# Altium schematic sheet Connectors.SchDoc
size A3; SheetNumber: 4; SheetTotal: 7
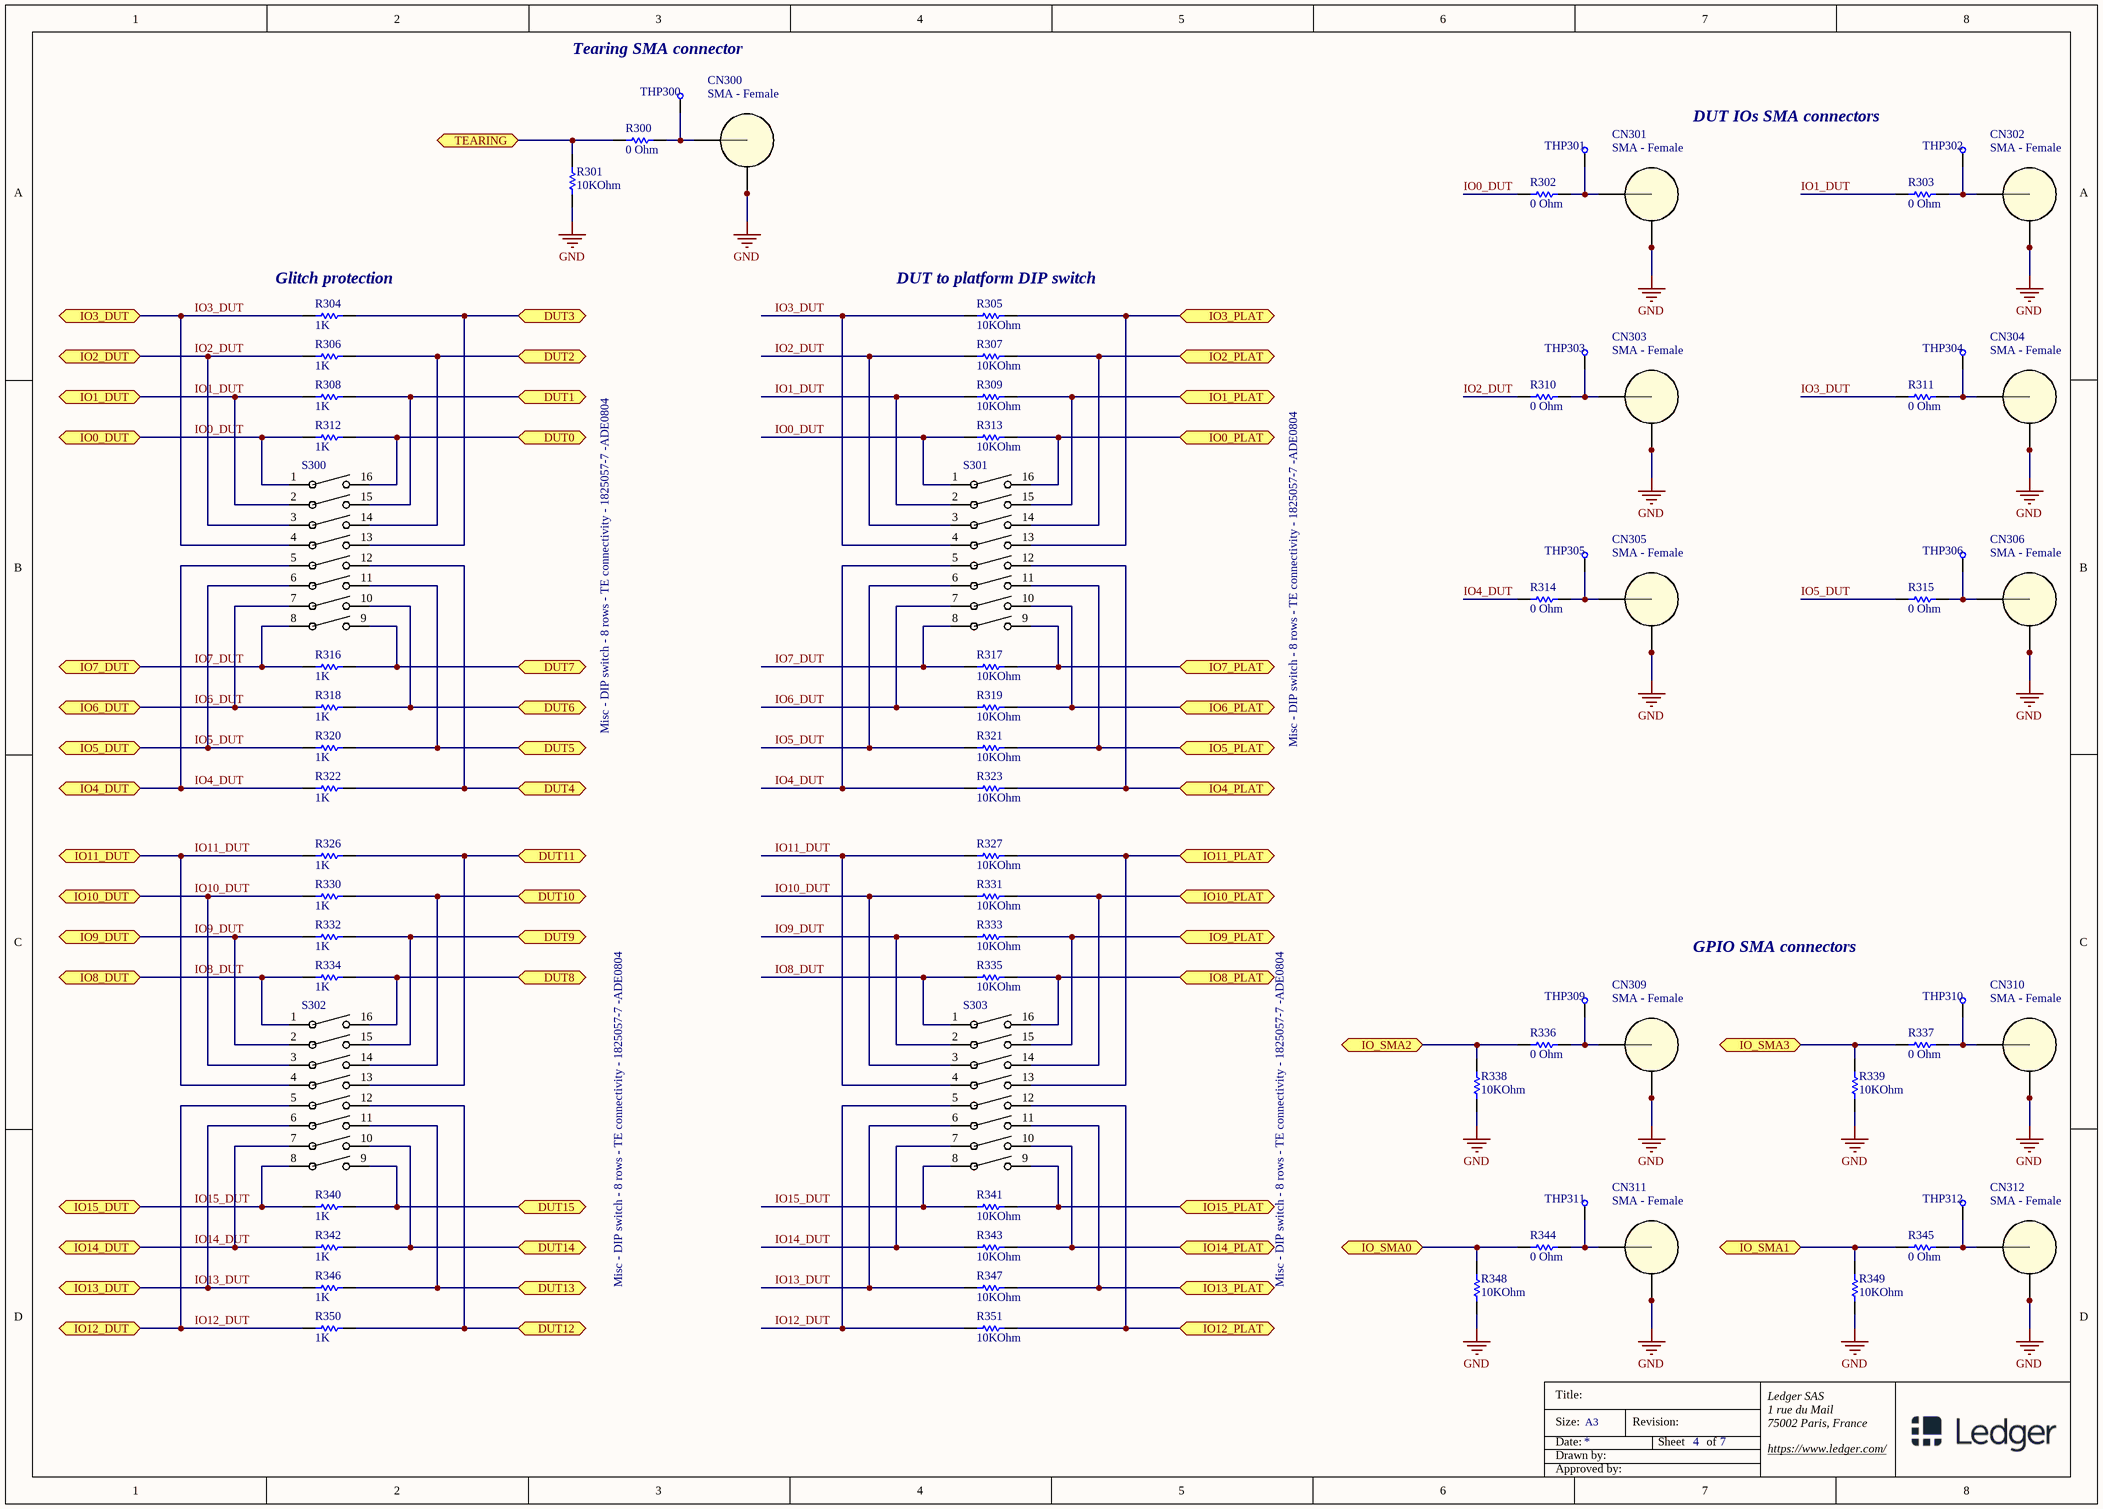
[diagram p0: Connectors.SchDoc]

## Parts
CN300  SMA - Female  [SAMTEC_SMA-J-P-X-ST-EM3]
CN301  SMA - Female  [SAMTEC_SMA-J-P-X-ST-EM3]
CN302  SMA - Female  [SAMTEC_SMA-J-P-X-ST-EM3]
CN303  SMA - Female  [SAMTEC_SMA-J-P-X-ST-EM3]
CN304  SMA - Female  [SAMTEC_SMA-J-P-X-ST-EM3]
CN305  SMA - Female  [SAMTEC_SMA-J-P-X-ST-EM3]
CN306  SMA - Female  [SAMTEC_SMA-J-P-X-ST-EM3]
CN309  SMA - Female  [SAMTEC_SMA-J-P-X-ST-EM3]
CN310  SMA - Female  [SAMTEC_SMA-J-P-X-ST-EM3]
CN311  SMA - Female  [SAMTEC_SMA-J-P-X-ST-EM3]
CN312  SMA - Female  [SAMTEC_SMA-J-P-X-ST-EM3]
R300  0 Ohm  [RES0603]
R301  10KOhm  [RES0603]
R302  0 Ohm  [RES0603]
R303  0 Ohm  [RES0603]
R304  1K  [RES0603]
R305  10KOhm  [RES0603]
R306  1K  [RES0603]
R307  10KOhm  [RES0603]
R308  1K  [RES0603]
R309  10KOhm  [RES0603]
R310  0 Ohm  [RES0603]
R311  0 Ohm  [RES0603]
R312  1K  [RES0603]
R313  10KOhm  [RES0603]
R314  0 Ohm  [RES0603]
R315  0 Ohm  [RES0603]
R316  1K  [RES0603]
R317  10KOhm  [RES0603]
R318  1K  [RES0603]
R319  10KOhm  [RES0603]
R320  1K  [RES0603]
R321  10KOhm  [RES0603]
R322  1K  [RES0603]
R323  10KOhm  [RES0603]
R326  1K  [RES0603]
R327  10KOhm  [RES0603]
R330  1K  [RES0603]
R331  10KOhm  [RES0603]
R332  1K  [RES0603]
R333  10KOhm  [RES0603]
R334  1K  [RES0603]
R335  10KOhm  [RES0603]
R336  0 Ohm  [RES0603]
R337  0 Ohm  [RES0603]
R338  10KOhm  [RES0603]
R339  10KOhm  [RES0603]
R340  1K  [RES0603]
R341  10KOhm  [RES0603]
R342  1K  [RES0603]
R343  10KOhm  [RES0603]
R344  0 Ohm  [RES0603]
R345  0 Ohm  [RES0603]
R346  1K  [RES0603]
R347  10KOhm  [RES0603]
R348  10KOhm  [RES0603]
R349  10KOhm  [RES0603]
R350  1K  [RES0603]
R351  10KOhm  [RES0603]
S300  Misc - DIP switch - 8 rows - TE connectivity - 1825057-7 -ADE0804  [SWDIP16_300X3.51]
S301  Misc - DIP switch - 8 rows - TE connectivity - 1825057-7 -ADE0804  [SWDIP16_300X3.51]
S302  Misc - DIP switch - 8 rows - TE connectivity - 1825057-7 -ADE0804  [SWDIP16_300X3.51]
S303  Misc - DIP switch - 8 rows - TE connectivity - 1825057-7 -ADE0804  [SWDIP16_300X3.51]
THP300  Misc - Test pin - Through hole - Millmax - 6821-0-00-15-00-00-08-0  [MILLMAX_6821-0-00-15-00-00-08-0]  (value not drawn)
THP301  Misc - Test pin - Through hole - Millmax - 6821-0-00-15-00-00-08-0  [MILLMAX_6821-0-00-15-00-00-08-0]  (value not drawn)
THP302  Misc - Test pin - Through hole - Millmax - 6821-0-00-15-00-00-08-0  [MILLMAX_6821-0-00-15-00-00-08-0]  (value not drawn)
THP303  Misc - Test pin - Through hole - Millmax - 6821-0-00-15-00-00-08-0  [MILLMAX_6821-0-00-15-00-00-08-0]  (value not drawn)
THP304  Misc - Test pin - Through hole - Millmax - 6821-0-00-15-00-00-08-0  [MILLMAX_6821-0-00-15-00-00-08-0]  (value not drawn)
THP305  Misc - Test pin - Through hole - Millmax - 6821-0-00-15-00-00-08-0  [MILLMAX_6821-0-00-15-00-00-08-0]  (value not drawn)
THP306  Misc - Test pin - Through hole - Millmax - 6821-0-00-15-00-00-08-0  [MILLMAX_6821-0-00-15-00-00-08-0]  (value not drawn)
THP309  Misc - Test pin - Through hole - Millmax - 6821-0-00-15-00-00-08-0  [MILLMAX_6821-0-00-15-00-00-08-0]  (value not drawn)
THP310  Misc - Test pin - Through hole - Millmax - 6821-0-00-15-00-00-08-0  [MILLMAX_6821-0-00-15-00-00-08-0]  (value not drawn)
THP311  Misc - Test pin - Through hole - Millmax - 6821-0-00-15-00-00-08-0  [MILLMAX_6821-0-00-15-00-00-08-0]  (value not drawn)
THP312  Misc - Test pin - Through hole - Millmax - 6821-0-00-15-00-00-08-0  [MILLMAX_6821-0-00-15-00-00-08-0]  (value not drawn)

## Ports
DUT0, DUT1, DUT2, DUT3, DUT4, DUT5, DUT6, DUT7, DUT8, DUT9, DUT10, DUT11, DUT12, DUT13, DUT14, DUT15, IO0_DUT, IO0_PLAT, IO1_DUT, IO1_PLAT, IO2_DUT, IO2_PLAT, IO3_DUT, IO3_PLAT, IO4_DUT, IO4_PLAT, IO5_DUT, IO5_PLAT, IO6_DUT, IO6_PLAT, IO7_DUT, IO7_PLAT, IO8_DUT, IO8_PLAT, IO9_DUT, IO9_PLAT, IO10_DUT, IO10_PLAT, IO11_DUT, IO11_PLAT, IO12_DUT, IO12_PLAT, IO13_DUT, IO13_PLAT, IO14_DUT, IO14_PLAT, IO15_DUT, IO15_PLAT, IO_SMA0, IO_SMA1, IO_SMA2, IO_SMA3, TEARING

## Nets
GND: CN300.2 CN300.3 CN301.2 CN301.3 CN302.2 CN302.3 CN303.2 CN303.3 CN304.2 CN304.3 CN305.2 CN305.3 CN306.2 CN306.3 CN309.2 CN309.3 CN310.2 CN310.3 CN311.2 CN311.3 CN312.2 CN312.3 R301.1 R338.1 R339.1 R348.1 R349.1
DUT0: R312.2 S300.16 ; port DUT0
DUT1: R308.2 S300.15 ; port DUT1
DUT2: R306.2 S300.14 ; port DUT2
DUT3: R304.2 S300.13 ; port DUT3
DUT4: R322.2 S300.12 ; port DUT4
DUT5: R320.2 S300.11 ; port DUT5
DUT6: R318.2 S300.10 ; port DUT6
DUT7: R316.2 S300.9 ; port DUT7
DUT8: R334.2 S302.16 ; port DUT8
DUT9: R332.2 S302.15 ; port DUT9
DUT10: R330.2 S302.14 ; port DUT10
DUT11: R326.2 S302.13 ; port DUT11
DUT12: R350.2 S302.12 ; port DUT12
DUT13: R346.2 S302.11 ; port DUT13
DUT14: R342.2 S302.10 ; port DUT14
DUT15: R340.2 S302.9 ; port DUT15
IO0_DUT: R302.1 R312.1 R313.1 S300.1 S301.1 ; port IO0_DUT
IO0_PLAT: R313.2 S301.16 ; port IO0_PLAT
IO1_DUT: R303.1 R308.1 R309.1 S300.2 S301.2 ; port IO1_DUT
IO1_PLAT: R309.2 S301.15 ; port IO1_PLAT
IO2_DUT: R306.1 R307.1 R310.1 S300.3 S301.3 ; port IO2_DUT
IO2_PLAT: R307.2 S301.14 ; port IO2_PLAT
IO3_DUT: R304.1 R305.1 R311.1 S300.4 S301.4 ; port IO3_DUT
IO3_PLAT: R305.2 S301.13 ; port IO3_PLAT
IO4_DUT: R314.1 R322.1 R323.1 S300.5 S301.5 ; port IO4_DUT
IO4_PLAT: R323.2 S301.12 ; port IO4_PLAT
IO5_DUT: R315.1 R320.1 R321.1 S300.6 S301.6 ; port IO5_DUT
IO5_PLAT: R321.2 S301.11 ; port IO5_PLAT
IO6_DUT: R318.1 R319.1 S300.7 S301.7 ; port IO6_DUT
IO6_PLAT: R319.2 S301.10 ; port IO6_PLAT
IO7_DUT: R316.1 R317.1 S300.8 S301.8 ; port IO7_DUT
IO7_PLAT: R317.2 S301.9 ; port IO7_PLAT
IO8_DUT: R334.1 R335.1 S302.1 S303.1 ; port IO8_DUT
IO8_PLAT: R335.2 S303.16 ; port IO8_PLAT
IO9_DUT: R332.1 R333.1 S302.2 S303.2 ; port IO9_DUT
IO9_PLAT: R333.2 S303.15 ; port IO9_PLAT
IO10_DUT: R330.1 R331.1 S302.3 S303.3 ; port IO10_DUT
IO10_PLAT: R331.2 S303.14 ; port IO10_PLAT
IO11_DUT: R326.1 R327.1 S302.4 S303.4 ; port IO11_DUT
IO11_PLAT: R327.2 S303.13 ; port IO11_PLAT
IO12_DUT: R350.1 R351.1 S302.5 S303.5 ; port IO12_DUT
IO12_PLAT: R351.2 S303.12 ; port IO12_PLAT
IO13_DUT: R346.1 R347.1 S302.6 S303.6 ; port IO13_DUT
IO13_PLAT: R347.2 S303.11 ; port IO13_PLAT
IO14_DUT: R342.1 R343.1 S302.7 S303.7 ; port IO14_DUT
IO14_PLAT: R343.2 S303.10 ; port IO14_PLAT
IO15_DUT: R340.1 R341.1 S302.8 S303.8 ; port IO15_DUT
IO15_PLAT: R341.2 S303.9 ; port IO15_PLAT
IO_SMA0: R344.1 R348.2 ; port IO_SMA0
IO_SMA1: R345.1 R349.2 ; port IO_SMA1
IO_SMA2: R336.1 R338.2 ; port IO_SMA2
IO_SMA3: R337.1 R339.2 ; port IO_SMA3
TEARING: R300.1 R301.2 ; port TEARING
NetCN300_1: CN300.1 R300.2 THP300.1
NetCN301_1: CN301.1 R302.2 THP301.1
NetCN302_1: CN302.1 R303.2 THP302.1
NetCN303_1: CN303.1 R310.2 THP303.1
NetCN304_1: CN304.1 R311.2 THP304.1
NetCN305_1: CN305.1 R314.2 THP305.1
NetCN306_1: CN306.1 R315.2 THP306.1
NetCN309_1: CN309.1 R336.2 THP309.1
NetCN310_1: CN310.1 R337.2 THP310.1
NetCN311_1: CN311.1 R344.2 THP311.1
NetCN312_1: CN312.1 R345.2 THP312.1

## Notes on the sheet
- (near THP300) Tearing SMA connector
- DUT IOs SMA connectors
- (near R304) Glitch protection
- (near R305) DUT to platform DIP switch
- GPIO SMA connectors
- Title:
- Size:
- Date:
- Drawn by:
- A3
- Revision:
- Sheet
- of
- Ledger SAS
- 1 rue du Mail
- 75002 Paris, France
- https://www.ledger.com/
- Approved by:

## Library data of the parts
CN300-CN306 CN309-CN312 = Connector - SMA - Female - Horizontal - Mid Mount - Samtec - SMA–J–P–H–ST–EM3: pin to pad: 1>S1 2>G1 3>G2; Impedance: 50 Ohms; Manufacturer: Samtec; Manufacturer PN: SMA–J–P–H–ST–EM3; Type: SMA; Gender: Female
R300 R302 R303 R310 R311 R314 R315 R336 R337 R344 R345 = Resistor 0603 -        0Ohm - 1/10W - 1%: Resistor 0603 - 0Ohm - 1/10W - 1%; Manufacturer PN: CRCW06030000FKEA; Manufacturer: Vishay; PkgCode: 0603; Value: 0 Ohm; Power: 1/10W; Tolerance: 1%
R301 R305 R307 R309 R313 R317 R319 R321 R323 R327 R331 R333 R335 R338 R339 R341 R343 R347-R349 R351 = Resistor 0603 -    10KOhm - 1/10W - 1%: Manufacturer: Yageo; Manufacturer PN: RC0603FR-0710KL; Manufacturer1: Panasonic; Manufacturer1 PN: ERJ3EKF1002; Manufacturer2 PN: RK73H1JHT..1002F; PkgCode: 0603; Value: 10KOhm; Tolerance: 1%; Power: 1/10W; Manufacturer2: KOA Speer
R304 R306 R308 R312 R316 R318 R320 R322 R326 R330 R332 R334 R340 R342 R346 R350 = Resistor 0603 -      1KOhm - 1/10W - 1%: Resistor 0603 - 1KOhm - 1/10W - 1%; Manufacturer: Yageo; Manufacturer PN: RC0603FR-071KL; PkgCode: 0603; Value: 1K; Tolerance: 1%; Power: 1/10W
S300-S303 = Misc - DIP switch - 8 rows - TE connectivity - 1825057-7 -ADE0804: Misc - DIP switch - 8 rows - TE connectivity - 1825057-7; Nb rows: 8; Manufacturer: TE Connectivity; Manufacturer PN1: ADE0804; Manufacturer PN: 1825057-7
THP300-THP306 THP309-THP312 = Misc - Test pin - Through hole - Millmax - 6821-0-00-15-00-00-08-0: Manufacturer: Mill-max; Manufacturer PN: 6821-0-00-15-00-00-08-0